# EAGLE design Diseño_de_FISICA_v16 (EAGLE 9.6.2)
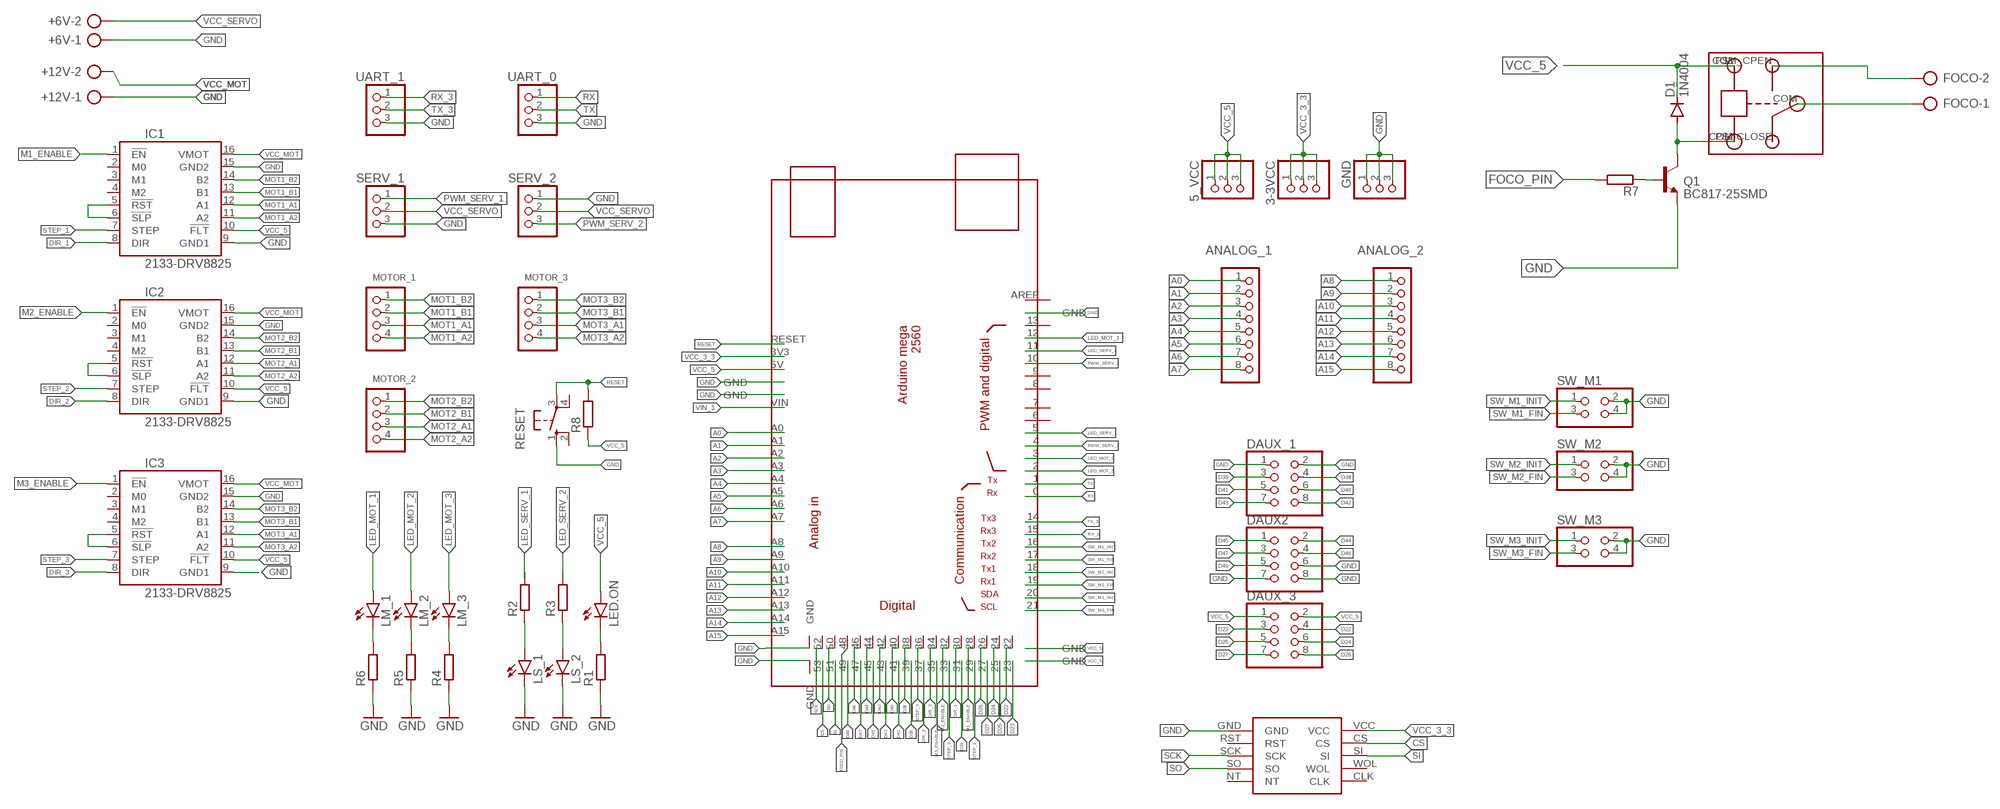
[diagram p0: schematic, sheet 1]

## Parts
3-3VCC  PINHD-1X3  [1X03]
5_VCC  PINHD-1X3  [1X03]
+6V  AK300/2  [AK300/2]
+12V  AK300/2  [AK300/2]
ANALOG_1  PINHD-1X8  [1X08]
ANALOG_2  PINHD-1X8  [1X08]
ARDUINOMEGA2560  MEGA_DEVICE  [MEGAOUTLINE]
D1  1N4004  [DO41-10]
DAUX2  PINHD-2X4  [2X04]
DAUX_1  PINHD-2X4  [2X04]
DAUX_3  PINHD-2X4  [2X04]
FOCO  AK300/2  [AK300/2]
GND  PINHD-1X3  [1X03]
IC1  2133-DRV8825  [DRV8825]
IC2  2133-DRV8825  [DRV8825]
IC3  2133-DRV8825  [DRV8825]
LED.ON  LED3MM  [LED3MM]
LM_1  LED3MM  [LED3MM]
LM_2  LED3MM  [LED3MM]
LM_3  LED3MM  [LED3MM]
LS_1  LED3MM  [LED3MM]
LS_2  LED3MM  [LED3MM]
MODULO_ETHERNET  ENC28J60  [ENC28J60]
MOTOR_1  PINHD-1X4  [1X04]
MOTOR_2  PINHD-1X4  [1X04]
MOTOR_3  PINHD-1X4  [1X04]
Q1  BC817-25SMD  [SOT23-BEC]
R1  R_CHIP-0805(2012-METRIC)  [RESC2012X65]
R2  R_CHIP-0805(2012-METRIC)  [RESC2012X65]
R3  R_CHIP-0805(2012-METRIC)  [RESC2012X65]
R4  R_CHIP-0805(2012-METRIC)  [RESC2012X65]
R5  R_CHIP-0805(2012-METRIC)  [RESC2012X65]
R6  R_CHIP-0805(2012-METRIC)  [RESC2012X65]
R7  R_CHIP-0805(2012-METRIC)  [RESC2012X65]
R8  R_CHIP-0805(2012-METRIC)  [RESC2012X65]
RESET  10-XX  [B3F-10XX]
SERV_1  PINHD-1X3  [1X03]
SERV_2  PINHD-1X3  [1X03]
SW_M1  PINHD-2X2  [2X02]
SW_M2  PINHD-2X2  [2X02]
SW_M3  PINHD-2X2  [2X02]
U$1  RELAY  [RELAY]
UART_0  PINHD-1X3  [1X03]
UART_1  PINHD-1X3  [1X03]

## Nets
A0: ANALOG_1.1 ARDUINOMEGA2560.A0
A1: ANALOG_1.2 ARDUINOMEGA2560.A1
A2: ANALOG_1.3 ARDUINOMEGA2560.A2
A3: ANALOG_1.4 ARDUINOMEGA2560.A3
A4: ANALOG_1.5 ARDUINOMEGA2560.A4
A5: ANALOG_1.6 ARDUINOMEGA2560.A5
A6: ANALOG_1.7 ARDUINOMEGA2560.A6
A7: ANALOG_1.8 ARDUINOMEGA2560.A7
A8: ANALOG_2.1 ARDUINOMEGA2560.A8
A9: ANALOG_2.2 ARDUINOMEGA2560.A9
A10: ANALOG_2.3 ARDUINOMEGA2560.A10
A11: ANALOG_2.4 ARDUINOMEGA2560.A11
A12: ANALOG_2.5 ARDUINOMEGA2560.A12
A13: ANALOG_2.6 ARDUINOMEGA2560.A13
A14: ANALOG_2.7 ARDUINOMEGA2560.A14
A15: ANALOG_2.8 ARDUINOMEGA2560.A15
CS: ARDUINOMEGA2560.53 MODULO_ETHERNET.CS
D22: ARDUINOMEGA2560.22 DAUX_3.4
D23: ARDUINOMEGA2560.23 DAUX_3.3
D24: ARDUINOMEGA2560.24 DAUX_3.6
D25: ARDUINOMEGA2560.25 DAUX_3.5
D26: ARDUINOMEGA2560.26 DAUX_3.8
D27: ARDUINOMEGA2560.27 DAUX_3.7
D31: ARDUINOMEGA2560.31
D38: ARDUINOMEGA2560.38 DAUX_1.4
D39: ARDUINOMEGA2560.39 DAUX_1.3
D40: ARDUINOMEGA2560.40 DAUX_1.6
D41: ARDUINOMEGA2560.41 DAUX_1.5
D42: ARDUINOMEGA2560.42 DAUX_1.8
D43: ARDUINOMEGA2560.43 DAUX_1.7
D44: ARDUINOMEGA2560.44 DAUX2.2
D45: ARDUINOMEGA2560.45 DAUX2.1
D46: ARDUINOMEGA2560.46 DAUX2.4
D47: ARDUINOMEGA2560.47 DAUX2.3
D49: ARDUINOMEGA2560.49 DAUX2.5
DIR_1: ARDUINOMEGA2560.30 IC1.8(DIR)
DIR_2: ARDUINOMEGA2560.34 IC2.8(DIR)
DIR_3: ARDUINOMEGA2560.37 IC3.8(DIR)
FOCO_PIN: ARDUINOMEGA2560.48 R7.2
GND: +6V.1 +12V.1 ARDUINOMEGA2560.GND@1(GND) ARDUINOMEGA2560.GND@2(GND) ARDUINOMEGA2560.GND@3(GND) ARDUINOMEGA2560.GND@6(GND) ARDUINOMEGA2560.GND@7(GND) DAUX2.6 DAUX2.7 DAUX2.8 DAUX_1.1 DAUX_1.2 GND.1 GND.2 GND.3 IC1.9(GND1) IC1.15(GND2) IC2.9(GND1) IC2.15(GND2) IC3.9(GND1) IC3.15(GND2) LS_1.K(C) LS_2.K(C) MODULO_ETHERNET.GND Q1.E R1.1 R4.1 R5.1 R6.1 RESET.1(S) SERV_1.3 SERV_2.1 SW_M1.2 SW_M1.4 SW_M2.2 SW_M2.4 SW_M3.2 SW_M3.4 UART_0.3 UART_1.3
LED_MOT_1: ARDUINOMEGA2560.12 LM_1.A
LED_MOT_2: ARDUINOMEGA2560.3 LM_2.A
LED_MOT_3: ARDUINOMEGA2560.2 LM_3.A
LED_SERV_1: ARDUINOMEGA2560.5 R2.2
LED_SERV_2: ARDUINOMEGA2560.11 R3.2
M1_ENABLE: ARDUINOMEGA2560.28 IC1.1(!EN)
M2_ENABLE: ARDUINOMEGA2560.32 IC2.1(!EN)
M3_ENABLE: ARDUINOMEGA2560.35 IC3.1(!EN)
MOT1_A1: IC1.12(A1) MOTOR_1.3
MOT1_A2: IC1.11(A2) MOTOR_1.4
MOT1_B1: IC1.13(B1) MOTOR_1.2
MOT1_B2: IC1.14(B2) MOTOR_1.1
MOT2_A1: IC2.12(A1) MOTOR_2.3
MOT2_A2: IC2.11(A2) MOTOR_2.4
MOT2_B1: IC2.13(B1) MOTOR_2.2
MOT2_B2: IC2.14(B2) MOTOR_2.1
MOT3_A1: IC3.12(A1) MOTOR_3.3
MOT3_A2: IC3.11(A2) MOTOR_3.4
MOT3_B1: IC3.13(B1) MOTOR_3.2
MOT3_B2: IC3.14(B2) MOTOR_3.1
N$1: FOCO.2 U$1.COM_CPEN(COM-OPEN)
N$2: D1.A Q1.C U$1.P$2(GND)
N$3: FOCO.1 U$1.COM
N$4: Q1.B R7.1
N$5: LS_1.A R2.1
N$6: LS_2.A R3.1
N$7: IC2.5(!RST) IC2.6(!SLP)
N$8: IC1.5(!RST) IC1.6(!SLP)
N$9: IC3.5(!RST) IC3.6(!SLP)
N$20: LED.ON.K(C) R1.2
N$23: LM_3.K(C) R4.2
N$24: LM_2.K(C) R5.2
N$25: LM_1.K(C) R6.2
PWM_SERV_1: ARDUINOMEGA2560.4 SERV_1.1
PWM_SERV_2: ARDUINOMEGA2560.10 SERV_2.3
RESET: ARDUINOMEGA2560.RESET R8.2 RESET.3(P)
RX: ARDUINOMEGA2560.0 UART_0.1
RX_3: ARDUINOMEGA2560.15 UART_1.1
SCK: ARDUINOMEGA2560.52 MODULO_ETHERNET.SCK
SI: ARDUINOMEGA2560.51 MODULO_ETHERNET.SI
SO: ARDUINOMEGA2560.50 MODULO_ETHERNET.SO
STEP_1: ARDUINOMEGA2560.29 IC1.7(STEP)
STEP_2: ARDUINOMEGA2560.33 IC2.7(STEP)
STEP_3: ARDUINOMEGA2560.36 IC3.7(STEP)
SW_M1_FIN: ARDUINOMEGA2560.17 SW_M1.3
SW_M1_INIT: ARDUINOMEGA2560.16 SW_M1.1
SW_M2_FIN: ARDUINOMEGA2560.19 SW_M2.3
SW_M2_INIT: ARDUINOMEGA2560.18 SW_M2.1
SW_M3_FIN: ARDUINOMEGA2560.21 SW_M3.3
SW_M3_INIT: ARDUINOMEGA2560.20 SW_M3.1
TX: ARDUINOMEGA2560.1 UART_0.2
TX_3: ARDUINOMEGA2560.14 UART_1.2
VCC_3_3: 3-3VCC.1 3-3VCC.2 3-3VCC.3 ARDUINOMEGA2560.3V3 MODULO_ETHERNET.VCC
VCC_5: 5_VCC.1 5_VCC.2 5_VCC.3 ARDUINOMEGA2560.5V ARDUINOMEGA2560.GND@4(GND) ARDUINOMEGA2560.GND@5(GND) D1.C DAUX_3.1 DAUX_3.2 IC1.10(!FLT) IC2.10(!FLT) IC3.10(!FLT) LED.ON.A R8.1 U$1.P$1(IN)
VCC_MOT: +12V.2 IC1.16(VMOT) IC2.16(VMOT) IC3.16(VMOT)
VCC_SERVO: +6V.2 SERV_1.2 SERV_2.2
VIN_1: ARDUINOMEGA2560.VIN
Unconnected: ARDUINOMEGA2560.6 ARDUINOMEGA2560.7 ARDUINOMEGA2560.8 ARDUINOMEGA2560.9 ARDUINOMEGA2560.13 ARDUINOMEGA2560.AREF IC1.2(M0) IC1.3(M1) IC1.4(M2) IC2.2(M0) IC2.3(M1) IC2.4(M2) IC3.2(M0) IC3.3(M1) IC3.4(M2) MODULO_ETHERNET.CLK MODULO_ETHERNET.NT MODULO_ETHERNET.RST MODULO_ETHERNET.WOL RESET.2(S1) RESET.4(P1) U$1.COM-CLOSE

## Library data of the parts
3-3VCC 5_VCC GND SERV_1 SERV_2 UART_0 UART_1 = Connector:PINHD-1X3: PIN HEADER; CATEGORY: CONNECTOR; SUB-CATEGORY: PIN-HEADER
+6V +12V FOCO = con-ptr500:AK300/2: CONNECTOR; OC_FARNELL: unknown; OC_NEWARK: unknown
ANALOG_1 ANALOG_2 = Connector:PINHD-1X8: PIN HEADER; CATEGORY: CONNECTOR; SUB-CATEGORY: PIN-HEADER
ARDUINOMEGA2560 = ArduinoMegaOutline:MEGA_DEVICE: mega card as device
D1 = diode:1N4004: DIODE general purpose rectifier, 1 A
DAUX2 DAUX_1 DAUX_3 = adafruit:PINHD-2X4: PIN HEADER
IC1-IC3 = pololu-stepper-driver:2133-DRV8825: DRV8825 Stepper Motor Driver Carrier, High Current #2133 DRV8825 Stepper Motor Driver Carrier; High Current <https://www.pololu.com/product/2133> in Japan, Suzaku Lab. Ltd. <https://suzakugiken.jp/> #2133 DRV8825 大電流用ステッピングモータドライバ <https://szc.jp/po2133>
LED.ON LM_1-LM_3 LS_1 LS_2 = led:LED: LED OSRAM: - CHIPLED LG R971, LG N971, LY N971, LG Q971, LY Q971, LO R971, LY R971 LH N974, LH R974 LS Q976, LO Q976, LY Q976 LO Q996 - Hyper CHIPLED LW Q18S LB Q993, LB Q99A, LB R99A - SideLED LS A670, LO A670, LY A670, LG A670, LP A670 LB A673, LV A673, LT A673, LW A673 LH A674 LY A675 LS A676, LA A676, LO A676, LY A676, LW A676 LS A679, LY A679, LG A679 - Hyper Micro SIDELED® LS Y876, LA Y876, LO Y876, LY Y876 LT Y87S - SmartLED LW L88C, LW L88S LB L89C, LB L89S, LG L890 LS L89K, LO L89K, LY L89K LS L896, LA L896, LO L896, LY L896 - TOPLED LS T670, LO T670, LY T670, LG T670, LP T670 LSG T670, LSP T670, LSY T670, LOP T670, LYG T670 LG T671, LOG T671, LSG T671 LB T673, LV T673, LT T673, LW T673 LH T674 LS T676, LA T676, LO T676, LY T676, LB T676, LH T676, LSB T676, LW T676 LB T67C, LV T67C, LT T67C, LS T67K, LO T67K, LY T67K, LW E67C LS E67B, LA E67B, LO E67B, LY E67B, LB E67C, LV E67C, LT E67C LW T67C LS T679, LY T679, LG T679 LS T770, LO T770, LY T770, LG T770, LP T770 LB T773, LV T773, LT T773, LW T773 LH T774 LS E675, LA E675, LY E675, LS T675 LS T776, LA T776, LO T776, LY T776, LB T776 LHGB T686 LT T68C, LB T68C - Hyper Mini TOPLED® LB M676 - Mini TOPLED Santana® LG M470 LS M47K, LO M47K, LY M47K Source: http://www.osram.convergy.de LUXEON: - LUMILED® LXK2-PW12-R00, LXK2-PW12-S00, LXK2-PW14-U00, LXK2-PW14-V00 LXK2-PM12-R00, LXK2-PM12-S00, LXK2-PM14-U00 LXK2-PE12-Q00, LXK2-PE12-R00, LXK2-PE12-S00, LXK2-PE14-T00, LXK2-PE14-U00 LXK2-PB12-K00, LXK2-PB12-L00, LXK2-PB12-M00, LXK2-PB14-N00, LXK2-PB14-P00, LXK2-PB14-Q00 LXK2-PR12-L00, LXK2-PR12-M00, LXK2-PR14-Q00, LXK2-PR14-R00 LXK2-PD12-Q00, LXK2-PD12-R00, LXK2-PD12-S00 LXK2-PH12-R00, LXK2-PH12-S00 LXK2-PL12-P00, LXK2-PL12-Q00, LXK2-PL12-R00 Source: www.luxeon.com KINGBRIGHT: KA-3528ASYC Source: www.kingbright.com
MODULO_ETHERNET = ethernet-mikroavr:ENC28J60: ENC28J60, SHIELD EHTERNET, CREATE BY MIKROAVR.COM
MOTOR_1-MOTOR_3 = Connector:PINHD-1X4: PIN HEADER; CATEGORY: CONNECTOR; SUB-CATEGORY: PIN-HEADER
Q1 = transistor-npn:BC817*: NPN Transistor
R1-R8 = Resistor:R: Resistor Fixed - Generic; CATEGORY: Resistor; SUB-CATEGORY: Fixed
RESET = switch-omron:10-XX: OMRON SWITCH; MPN: B3F-1000; OC_FARNELL: 176432; OC_NEWARK: 36M3542
SW_M1-SW_M3 = pinhead:PINHD-2X2: PIN HEADER
U$1 = RELAY:RELAY

## Board
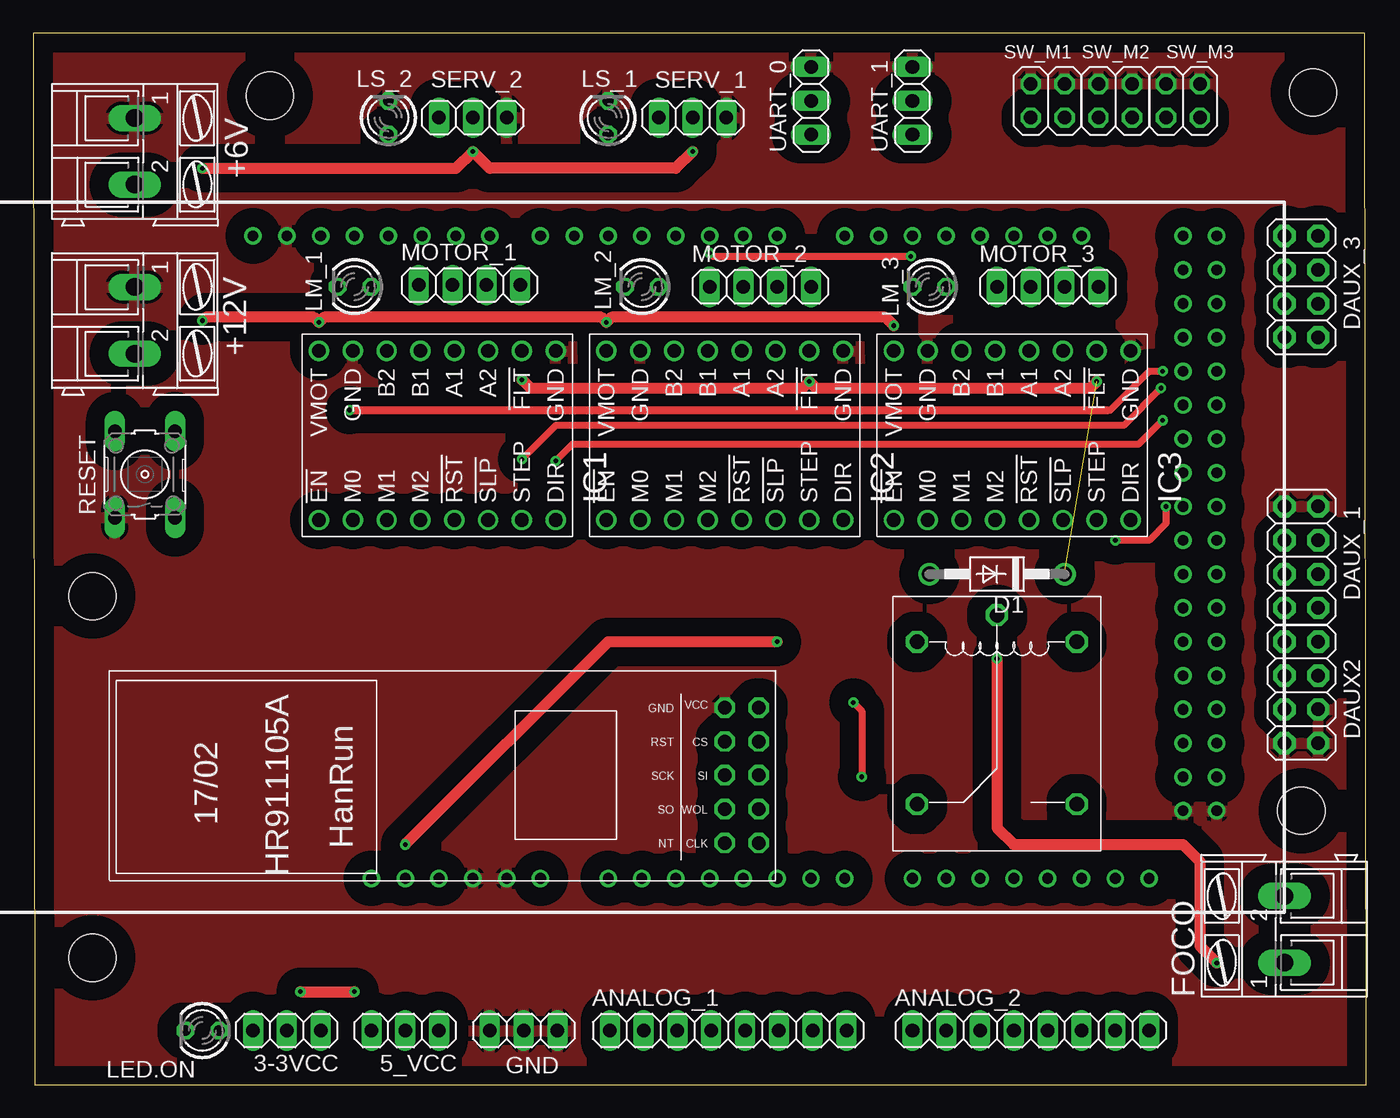
[diagram p1: board, top side]
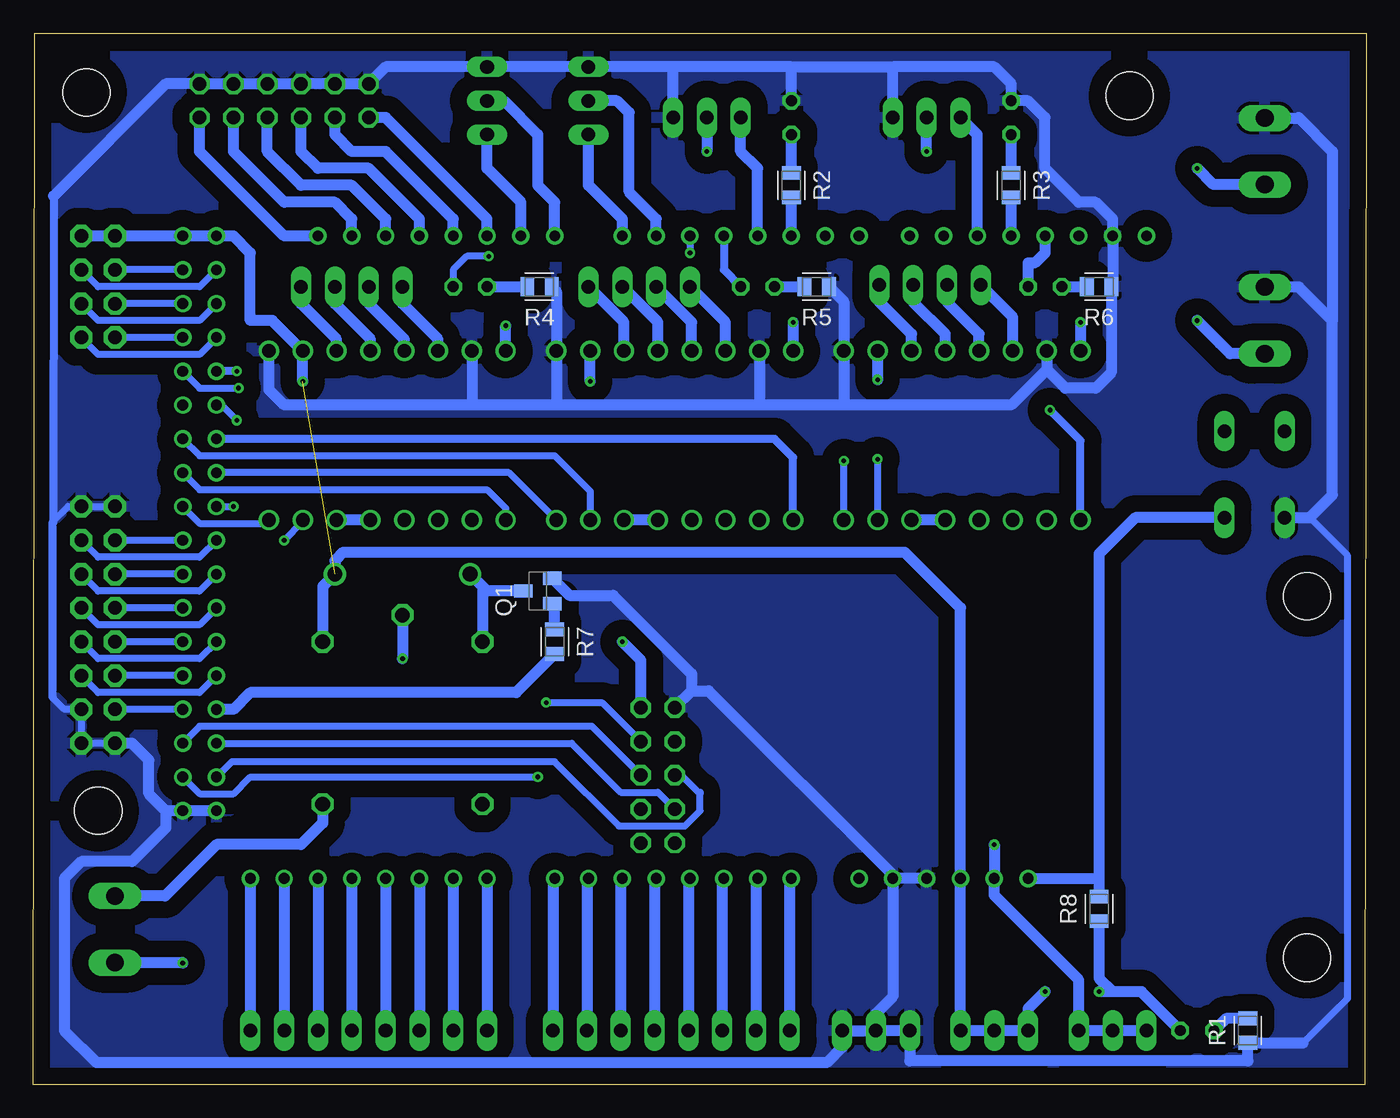
[diagram p2: board, bottom side, seen from below]

Size 100.13 x 78.98 mm. Coordinates in mm from the lower left corner, seen from the top.
Outline: 0.13,0 100.13,0 100,78.98 0,78.98 0.13,0
Copper layers (1*16): Top 0.035mm / dielectric 1.5mm / Bottom 0.035mm
Design rules "default": minimum track width 6mil, minimum drill 0.35mm, track to track 6mil, track to pad 6mil, pad to pad 6mil, via to via 6mil, smd to smd 6mil, copper to edge 40mil, drill to drill 6mil, minimum pad ring 10mil, minimum via ring 8mil, stop-mask expansion 4mil, vias tented up to drill 0mil, thermal gap 10mil
Holes 3.55 mm at 4.45,36.7 4.45,9.53 17.78,74.3 96.14,74.55 95.25,20.57

### Footprints (pad centres in the part's own frame; a part is rotated, then mirrored left to right if it is on the bottom)
1X03 = drill 1.016 long: 1 -2.54,0; 2 0,0; 3 2.54,0
AK300/2 = drill 1.321 long: 1 -2.515,0; 2 2.489,0
1X08 = drill 1.016 long: 1 -8.89,0; 2 -6.35,0; 3 -3.81,0; 4 -1.27,0; 5 1.27,0; 6 3.81,0; 7 6.35,0; 8 8.89,0
MEGAOUTLINE = drill 0.8: 0 12.7,24.13; 1 10.16,24.13; 2 7.62,24.13; 3 5.08,24.13; 3V3 -15.24,-24.13; 4 2.54,24.13; 5 0,24.13; 5V -12.7,-24.13; 6 -2.54,24.13; 7 -5.08,24.13; 8 -8.89,24.13; 9 -11.43,24.13; 10 -13.97,24.13; 11 -16.51,24.13; 12 -19.05,24.13; 13 -21.59,24.13; 14 17.78,24.13; 15 20.32,24.13; 16 22.86,24.13; 17 25.4,24.13; 18 27.94,24.13; 19 30.48,24.13; 20 33.02,24.13; 21 35.56,24.13; 22 43.18,21.59; 23 45.72,21.59; 24 43.18,19.05; 25 45.72,19.05; 26 43.18,16.51; 27 45.72,16.51; 28 43.18,13.97; 29 45.72,13.97; 30 43.18,11.43; 31 45.72,11.43; 32 43.18,8.89; 33 45.72,8.89; 34 43.18,6.35; 35 45.72,6.35; 36 43.18,3.81; 37 45.72,3.81; 38 43.18,1.27; 39 45.72,1.27; 40 43.18,-1.27; 41 45.72,-1.27; 42 43.18,-3.81; 43 45.72,-3.81; 44 43.18,-6.35; 45 45.72,-6.35; 46 43.18,-8.89; 47 45.72,-8.89; 48 43.18,-11.43; 49 45.72,-11.43; 50 43.18,-13.97; 51 45.72,-13.97; 52 43.18,-16.51; 53 45.72,-16.51; A0 0,-24.13; A1 2.54,-24.13; A2 5.08,-24.13; A3 7.62,-24.13; A4 10.16,-24.13; A5 12.7,-24.13; A6 15.24,-24.13; A7 17.78,-24.13; A8 22.86,-24.13; A9 25.4,-24.13; A10 27.94,-24.13; A11 30.48,-24.13; A12 33.02,-24.13; A13 35.56,-24.13; A14 38.1,-24.13; A15 40.64,-24.13; AREF -26.67,24.13; GND@1 -24.13,24.13; GND@2 -10.16,-24.13; GND@3 -7.62,-24.13; GND@4 43.18,24.13; GND@5 45.72,24.13; GND@6 43.18,-19.05; GND@7 45.72,-19.05; RESET -17.78,-24.13; VIN -5.08,-24.13
DO41-10 = drill 1.118: A 5.08,0; C -5.08,0
2X04 = drill 1.016 pad 1.676 octagon: 1 -3.81,-1.27; 2 -3.81,1.27; 3 -1.27,-1.27; 4 -1.27,1.27; 5 1.27,-1.27; 6 1.27,1.27; 7 3.81,-1.27; 8 3.81,1.27
DRV8825 = drill 1.016: 1 -6.35,8.89; 2 -6.35,6.35; 3 -6.35,3.81; 4 -6.35,1.27; 5 -6.35,-1.27; 6 -6.35,-3.81; 7 -6.35,-6.35; 8 -6.35,-8.89; 9 6.35,-8.89; 10 6.35,-6.35; 11 6.35,-3.81; 12 6.35,-1.27; 13 6.35,1.27; 14 6.35,3.81; 15 6.35,6.35; 16 6.35,8.89
LED3MM = drill 0.813 octagon: A -1.27,0; K 1.27,0
ENC28J60 = drill 1.016 octagon: CLK 1.27,2.54; CS 1.27,-5.08; GND 3.81,-7.62; NT 3.81,2.54; RST 3.81,-5.08; SCK 3.81,-2.54; SI 1.27,-2.54; SO 3.81,0; VCC 1.27,-7.62; WOL 1.27,0
1X04 = drill 1.016 long: 1 -3.81,0; 2 -1.27,0; 3 1.27,0; 4 3.81,0
SOT23-BEC = smd 1 x 1.4: B -0.95,-1.1; C 0,1.1; E 0.95,-1.1
RESC2012X65 = smd 1.031 x 1.42: 1 -0.919,0; 2 0.919,0
B3F-10XX = drill 1.016 long: 1 -3.251,2.261; 2 3.251,2.261; 3 -3.251,-2.261; 4 3.251,-2.261
2X02 = drill 1.016 octagon: 1 -1.27,-1.27; 2 -1.27,1.27; 3 1.27,-1.27; 4 1.27,1.27
RELAY = drill 1.1 octagon: COM -2,0; COM-CLOSE 12.2,-6; COM_CPEN 12.2,6; P$1 0,6; P$2 0,-6

### Placement (x,y rotation side)
3-3VCC  19.05,4.06 180 top
5_VCC  27.94,4.06 180 top
+6V  7.62,70.1 270 top
+12V  7.62,57.4 270 top
ANALOG_1  52.2,4.06 0 top
ANALOG_2  74.93,4.06 0 top
ARDUINOMEGA2560  43.18,39.62 0 top
D1  72.39,38.35 180 top
DAUX2  95.25,29.46 270 top
DAUX_1  95.25,39.62 270 top
DAUX_3  95.25,59.94 270 top
FOCO  93.98,11.68 90 top
GND  36.83,4.06 0 top
IC1  30.35,48.77 90 top
IC2  51.94,48.77 90 top
IC3  73.53,48.77 90 top
LED.ON  12.7,4.06 180 top
LM_1  24.13,59.94 180 top
LM_2  45.72,59.94 180 top
LM_3  67.31,59.94 180 top
LS_1  43.18,72.64 90 top
LS_2  26.67,72.64 90 top
MODULO_ETHERNET  55.75,20.7 180 top
MOTOR_1  32.77,60.07 0 top
MOTOR_2  54.61,59.94 0 top
MOTOR_3  76.2,59.94 0 top
Q1  62.23,37.08 90 bottom
R1  8.89,4.06 90 bottom
R2  43.18,67.56 270 bottom
R3  26.67,67.56 270 bottom
R4  62.1,59.94 180 bottom
R5  41.27,59.94 180 bottom
R6  20.07,59.94 180 bottom
R7  60.96,33.27 270 bottom
R8  20.07,13.21 90 bottom
RESET  8.38,45.85 90 top
SERV_1  49.53,72.64 0 top
SERV_2  33.02,72.64 180 top
SW_M1  76.2,73.91 0 top
SW_M2  81.28,73.91 0 top
SW_M3  86.36,73.91 0 top
U$1  72.39,33.27 270 top
UART_0  58.42,73.91 90 top
UART_1  66.04,73.91 90 top

### Tracks (layer width: path | path; a pad name or v marks a point on that pad's centre or on a via)
A0
  Bottom 0.813: ARDUINOMEGA2560.A0 43.31,15.37 ANALOG_1.1
A1
  Bottom 0.813: ARDUINOMEGA2560.A1 45.85,15.37 ANALOG_1.2
A2
  Bottom 0.813: ARDUINOMEGA2560.A2 48.39,15.37 ANALOG_1.3
A3
  Bottom 0.813: ARDUINOMEGA2560.A3 50.93,15.37 ANALOG_1.4
A4
  Bottom 0.813: ARDUINOMEGA2560.A4 53.47,15.37 ANALOG_1.5
A5
  Bottom 0.813: ARDUINOMEGA2560.A5 56.01,15.37 ANALOG_1.6
A6
  Bottom 0.813: ARDUINOMEGA2560.A6 58.55,15.37 ANALOG_1.7
A7
  Bottom 0.813: ARDUINOMEGA2560.A7 61.09,15.37 ANALOG_1.8
A8
  Bottom 0.813: ARDUINOMEGA2560.A8 ANALOG_2.1
A9
  Bottom 0.813: ARDUINOMEGA2560.A9 ANALOG_2.2
A10
  Bottom 0.813: ARDUINOMEGA2560.A10 ANALOG_2.3
A11
  Bottom 0.813: ARDUINOMEGA2560.A11 ANALOG_2.4
A12
  Bottom 0.813: ARDUINOMEGA2560.A12 ANALOG_2.5
A13
  Bottom 0.813: ARDUINOMEGA2560.A13 ANALOG_2.6
A14
  Bottom 0.813: ARDUINOMEGA2560.A14 ANALOG_2.7
A15
  Bottom 0.813: ARDUINOMEGA2560.A15 ANALOG_2.8
CS  (via drill 0.35)
  Top 0.508: v61.59,28.7 62.23,28.07 v62.23,23.11
  Bottom 0.508: ARDUINOMEGA2560.53 87.63,21.84 85.09,21.84 83.82,23.11 v62.23,23.11 | v61.59,28.7 57.4,28.7 MODULO_ETHERNET.CS
D22
  Bottom 0.508: ARDUINOMEGA2560.22 87.63,59.94 95.25,59.94 DAUX_3.4
D23
  Bottom 0.508: ARDUINOMEGA2560.23 DAUX_3.3
D24
  Bottom 0.508: ARDUINOMEGA2560.24 87.63,57.4 95.25,57.4 DAUX_3.6
D25
  Bottom 0.508: ARDUINOMEGA2560.25 DAUX_3.5
D26
  Bottom 0.508: ARDUINOMEGA2560.26 87.63,54.86 95.25,54.86 DAUX_3.8
D27
  Bottom 0.508: ARDUINOMEGA2560.27 DAUX_3.7
D38
  Bottom 0.508: ARDUINOMEGA2560.38 87.63,39.62 95.25,39.62 DAUX_1.4
D39
  Bottom 0.508: ARDUINOMEGA2560.39 DAUX_1.3
D40
  Bottom 0.508: ARDUINOMEGA2560.40 87.63,37.08 95.25,37.08 DAUX_1.6
D41
  Bottom 0.508: ARDUINOMEGA2560.41 DAUX_1.5
D42
  Bottom 0.508: ARDUINOMEGA2560.42 87.63,34.54 95.25,34.54 DAUX_1.8
D43
  Bottom 0.508: ARDUINOMEGA2560.43 DAUX_1.7
D44
  Bottom 0.508: ARDUINOMEGA2560.44 87.63,32 95.25,32 DAUX2.2
D45
  Bottom 0.508: ARDUINOMEGA2560.45 DAUX2.1
D46
  Bottom 0.508: ARDUINOMEGA2560.46 87.63,29.46 95.25,29.46 DAUX2.4
D47
  Bottom 0.508: ARDUINOMEGA2560.47 DAUX2.3
D49
  Bottom 0.508: ARDUINOMEGA2560.49 DAUX2.5
DIR_1  (via drill 0.35)
  Top 0.508: v39.24,46.86 40.51,48.13 83.06,48.13 v84.84,49.91
  Bottom 0.508: IC1.8 v39.24,46.86 | v84.84,49.91 85.98,51.05 ARDUINOMEGA2560.30
DIR_2
  Bottom 0.508: IC2.8 64.39,45.97 ARDUINOMEGA2560.34
DIR_3
  Bottom 0.508: ARDUINOMEGA2560.37 87.63,42.16 82.68,42.16 IC3.8
FOCO_PIN
  Bottom 0.813: R7.2 63.85,29.46 83.82,29.46 85.09,28.19 ARDUINOMEGA2560.48
GND
  Bottom 0.508: R4.1 60.83,59.59 | DAUX2.7 DAUX2.8 DAUX2.6 97.79,28.19 98.66,29.07 | 98.66,42.29 97.52,43.43 DAUX_1.2 DAUX_1.1 | 4.73,3.14 1.4,6.48 1.4,39.75 4.24,42.6
  Bottom 0.61: 98.66,29.07 98.66,42.29 | 98.6,66.75 98.64,42.16
  Bottom 0.813: GND.2 GND.3 39.37,2.79 40.51,1.65 95.38,1.65 97.79,4.06 97.79,15.49 96.52,16.76 92.71,16.76 90.17,19.3 90.17,20.57 | GND.2 GND.1 34.29,1.78 8.89,1.78 R1.1 4.73,3.14 | ARDUINOMEGA2560.GND@3 35.56,6.6 36.83,5.33 GND.2 | ARDUINOMEGA2560.GND@2 ARDUINOMEGA2560.GND@3 | IC1.15 24,53.72 | 39.37,51.05 26.67,51.05 24,53.72 | 39.37,51.05 45.72,51.05 | 45.72,51.05 60.96,51.05 | 60.96,51.05 67.31,51.05 | 67.31,51.05 81.28,51.05 82.42,52.2 IC3.9 | 39.37,51.05 39.24,51.18 IC1.9 39.24,58.83 R5.1 | IC2.15 45.59,51.18 45.72,51.05 | 60.96,51.05 60.83,51.18 IC2.9 60.83,59.59 | IC3.15 67.18,51.18 67.31,51.05 | 24,53.72 22.61,52.32 20.32,52.32 19.15,53.5 R6.1 19.05,60.04 ARDUINOMEGA2560.GND@1 19.05,65.02 20.32,66.29 21.59,66.29 24.13,68.83 24.13,72.64 25.4,73.91 LS_2.K 26.67,75.18 27.94,76.45 35.56,76.45 | ARDUINOMEGA2560.GND@3 35.56,15.75 49.4,29.59 50.67,29.59 | 50.67,29.59 50.67,30.86 56.58,36.76 59.86,36.76 Q1.E | 50.67,29.59 MODULO_ETHERNET.GND | SERV_2.1 35.56,76.45 | 43.18,76.45 52.07,76.45 | 52.07,76.45 UART_0.3 UART_1.3 73.66,76.45 SW_M1.2 SW_M1.4 SW_M2.2 SW_M2.4 SW_M3.2 SW_M3.4 90.17,75.18 98.6,66.75 | SERV_1.3 52.07,76.45 | LS_1.K 43.18,76.45 | 43.18,76.45 35.56,76.45 | ARDUINOMEGA2560.GND@6 ARDUINOMEGA2560.GND@7 90.17,20.57 | 90.17,20.57 91.44,21.84 91.44,24.38 92.71,25.65 DAUX2.7 | RESET.1 4.24,42.6 2.54,44.3 2.54,57.4 | 2.54,57.4 5.05,59.92 +12V.1 | +6V.1 5.11,72.62 5.08,72.64 2.54,70.1 2.54,57.4
  pour Bottom (isolate 1.27): 1.27,1.52 1.27,77.72 99.06,77.72 99.06,1.52
  pour Top (isolate 1.422): 1.27,1.52 1.27,77.34 98.55,77.34 98.55,1.4 1.4,1.4
LED_MOT_1
  Bottom 0.813: LM_1.A 25.4,61.72 24.89,61.72 24.13,62.48 ARDUINOMEGA2560.12
LED_MOT_2
  Bottom 0.61: ARDUINOMEGA2560.3 48.26,61.21 LM_2.A
LED_MOT_3  (via drill 0.35)
  Top 0.508: v50.8,62.48 51.05,62.23 v65.91,62.23
  Bottom 0.508: ARDUINOMEGA2560.2 v50.8,62.48 | v65.91,62.23 67.56,62.23 68.58,61.21 LM_3.A
LED_SERV_1
  Bottom 0.813: ARDUINOMEGA2560.5 R2.2
LED_SERV_2
  Bottom 0.813: ARDUINOMEGA2560.11 R3.2
M1_ENABLE  (via drill 0.35)
  Top 0.508: 80.64,50.67 80.9,50.67 83.82,53.59 v84.84,53.59
  Top 0.61: v23.75,50.67 80.64,50.67
  Bottom 0.61: v84.84,53.59 ARDUINOMEGA2560.28 | IC1.1 21.46,48.39 v23.75,50.67
M2_ENABLE
  Bottom 0.61: IC2.1 43.05,47.12 44.45,48.51 ARDUINOMEGA2560.32
M3_ENABLE
  Bottom 0.508: ARDUINOMEGA2560.35 87.63,44.7 66.04,44.7 64.64,43.31 IC3.1
MOT1_A1
  Bottom 0.813: MOTOR_1.3 34.04,58.8 31.62,56.39 IC1.12
MOT1_A2
  Bottom 0.813: MOTOR_1.4 36.58,58.8 34.16,56.39 IC1.11
MOT1_B1
  Bottom 0.813: MOTOR_1.2 31.5,58.8 29.08,56.39 IC1.13
MOT1_B2
  Bottom 0.813: MOTOR_1.1 26.54,57.66 IC1.14
MOT2_A1
  Bottom 0.813: IC2.12 53.21,57.28 MOTOR_2.3
MOT2_A2
  Bottom 0.813: IC2.11 55.75,57.28 MOTOR_2.4
MOT2_B1
  Bottom 0.813: IC2.13 50.67,57.28 MOTOR_2.2
MOT2_B2
  Bottom 0.813: IC2.14 48.13,57.28 MOTOR_2.1
MOT3_A1
  Bottom 0.813: IC3.12 74.8,56.01 77.47,58.67 MOTOR_3.3
MOT3_A2
  Bottom 0.813: IC3.11 77.34,56.01 80.01,58.67 MOTOR_3.4
MOT3_B1
  Bottom 0.813: IC3.13 72.26,56.01 74.93,58.67 MOTOR_3.2
MOT3_B2
  Bottom 0.813: IC3.14 69.72,56.01 72.39,58.67 MOTOR_3.1
N$1
  Bottom 0.813: U$1.COM_CPEN 78.39,19.65 80.01,18.03 86.36,18.03 90.22,14.17 FOCO.2
N$2
  Bottom 0.813: D1.A 66.39,37.43 | 66.39,37.43 U$1.P$2 | Q1.C 66.04,37.08 66.39,37.43
N$3  (via drill 0.35)
  Top 0.813: v72.39,32 72.39,19.3 73.66,18.03 86.36,18.03 87.63,16.76 87.63,10.41 v88.9,9.14
  Bottom 0.813: U$1.COM v72.39,32 | v88.9,9.14 88.92,9.17 FOCO.1
N$4
  Bottom 0.813: R7.1 60.96,35.96 Q1.B
N$5
  Bottom 0.813: R2.1 LS_1.A
N$6
  Bottom 0.813: R3.1 LS_2.A
N$7
  Bottom 0.813: IC2.5 IC2.6
N$8
  Bottom 0.813: IC1.5 IC1.6
N$9
  Bottom 0.813: IC3.5 IC3.6
N$20
  Bottom 0.813: R1.2 10.51,4.98 LED.ON.K
N$23
  Bottom 0.813: LM_3.K R4.2
N$24
  Bottom 0.813: LM_2.K R5.2
N$25
  Bottom 0.813: LM_1.K R6.2
PWM_SERV_1
  Bottom 0.813: ARDUINOMEGA2560.4 45.72,68.83 46.99,70.1 SERV_1.1
PWM_SERV_2
  Bottom 0.813: SERV_2.3 29.21,71.37 ARDUINOMEGA2560.10
RESET
  Bottom 0.813: RESET.3 17.35,42.6 20.07,39.88 R8.2 20.07,15.24 20.32,15.49 ARDUINOMEGA2560.RESET
RX
  Bottom 0.813: ARDUINOMEGA2560.0 55.88,65.02 58.42,67.56 UART_0.1
RX_3
  Bottom 0.813: ARDUINOMEGA2560.15 63.5,66.29 66.04,68.83 UART_1.1
SCK
  Bottom 0.508: ARDUINOMEGA2560.52 85.22,24.26 60.96,24.26 56.13,19.43 51.18,19.43 50.04,20.57 50.04,21.84 | 50.04,21.84 50.04,21.97 | 50.04,21.84 51.44,23.24 MODULO_ETHERNET.SCK
SI
  Bottom 0.508: MODULO_ETHERNET.SI 55.75,24.51 58.17,26.92 87.63,26.92 ARDUINOMEGA2560.51
SO
  Bottom 0.508: ARDUINOMEGA2560.50 59.69,25.65 56.01,21.97 53.21,21.97 MODULO_ETHERNET.SO
STEP_1  (via drill 0.35)
  Top 0.508: v84.71,52.32 81.92,49.53 39.24,49.53 v36.7,46.99
  Bottom 0.508: ARDUINOMEGA2560.29 87.63,52.32 v84.71,52.32 | v36.7,46.99 IC1.7
STEP_2
  Bottom 0.508: ARDUINOMEGA2560.33 87.63,47.24 60.96,47.24 58.29,44.58 IC2.7
STEP_3  (via drill 0.35)
  Top 0.508: v85.09,43.43 85.09,42.16 83.82,40.89 v81.28,40.89
  Bottom 0.508: ARDUINOMEGA2560.36 v85.09,43.43 | v81.28,40.89 79.88,42.29 IC3.7
SW_M1_FIN
  Bottom 0.813: ARDUINOMEGA2560.17 68.58,65.02 73.66,70.1 76.2,70.1 77.47,71.37 SW_M1.3
SW_M1_INIT
  Bottom 0.813: ARDUINOMEGA2560.16 66.04,65.02 73.66,72.64 SW_M1.1
SW_M2_FIN
  Bottom 0.813: ARDUINOMEGA2560.19 73.66,65.02 76.2,67.56 80.01,67.56 82.55,70.1 SW_M2.3
SW_M2_INIT
  Bottom 0.813: ARDUINOMEGA2560.18 71.12,65.02 74.93,68.83 78.74,68.83 80.01,70.1 SW_M2.1
SW_M3_FIN
  Bottom 0.813: ARDUINOMEGA2560.21 81.28,63.75 87.63,70.1 SW_M3.3
SW_M3_INIT
  Bottom 0.813: ARDUINOMEGA2560.20 76.2,65.02 77.47,66.29 81.28,66.29 85.09,70.1 SW_M3.1
TX
  Bottom 0.813: ARDUINOMEGA2560.1 53.34,65.02 55.37,67.06 55.37,73.02 56.26,73.91 UART_0.2
TX_3
  Bottom 0.813: ARDUINOMEGA2560.14 60.96,66.29 62.23,67.56 62.23,71.37 64.77,73.91 UART_1.2
VCC_3_3  (via drill 0.35)
  Top 0.813: v27.94,18.03 43.18,33.27 v55.88,33.27
  Bottom 0.813: 3-3VCC.3 3-3VCC.2 3-3VCC.1 21.59,7.87 27.94,14.22 ARDUINOMEGA2560.3V3 v27.94,18.03 | MODULO_ETHERNET.VCC 54.48,31.88 v55.88,33.27
VCC_5  (via drill 0.35)  (1 unrouted)
  Top 0.813: v36.7,52.96 37.34,52.32 57.78,52.32 v58.29,52.83 58.8,52.32 79.38,52.32 v79.88,52.83 | v20.07,6.98 v24.13,6.98
  Bottom 0.813: IC1.10 v36.7,52.96 | v58.29,52.83 IC2.10 | v79.88,52.83 IC3.10 82.17,57.4 83.82,57.4 83.82,62.48 85.09,63.75 ARDUINOMEGA2560.GND@4 ARDUINOMEGA2560.GND@5 DAUX_3.1 DAUX_3.2 | U$1.P$1 78.39,37.43 D1.C 77.47,39.37 76.83,40 34.67,40 30.48,35.81 ARDUINOMEGA2560.5V 5_VCC.1 5_VCC.2 5_VCC.3 25.4,5.71 v24.13,6.98 | LED.ON.A 16.89,6.98 19.05,6.98 | 19.05,6.98 v20.07,6.98 | R8.1 20.07,8 19.05,6.98
VCC_MOT  (via drill 0.35)
  Top 0.813: v64.64,57.02 64.01,57.66 43.43,57.66 v43.05,57.28 42.67,57.66 21.84,57.66 v21.46,57.28 21.08,57.66 12.95,57.66 v12.7,57.4
  Bottom 0.813: v43.05,57.28 IC2.16 | IC3.16 v64.64,57.02 | v21.46,57.28 IC1.16 | 11,55.7 v12.7,57.4 10.21,54.91 +12V.2
VCC_SERVO  (via drill 0.35)
  Top 0.813: v12.7,68.83 31.75,68.83 v33.02,70.1 34.29,68.83 48.26,68.83 v49.53,70.1
  Bottom 0.813: v33.02,70.1 SERV_2.2 | SERV_1.2 v49.53,70.1 | +6V.2 11.48,67.61 v12.7,68.83